# EAGLE schematic NeoGram c0.1 (EAGLE 9.5.2)
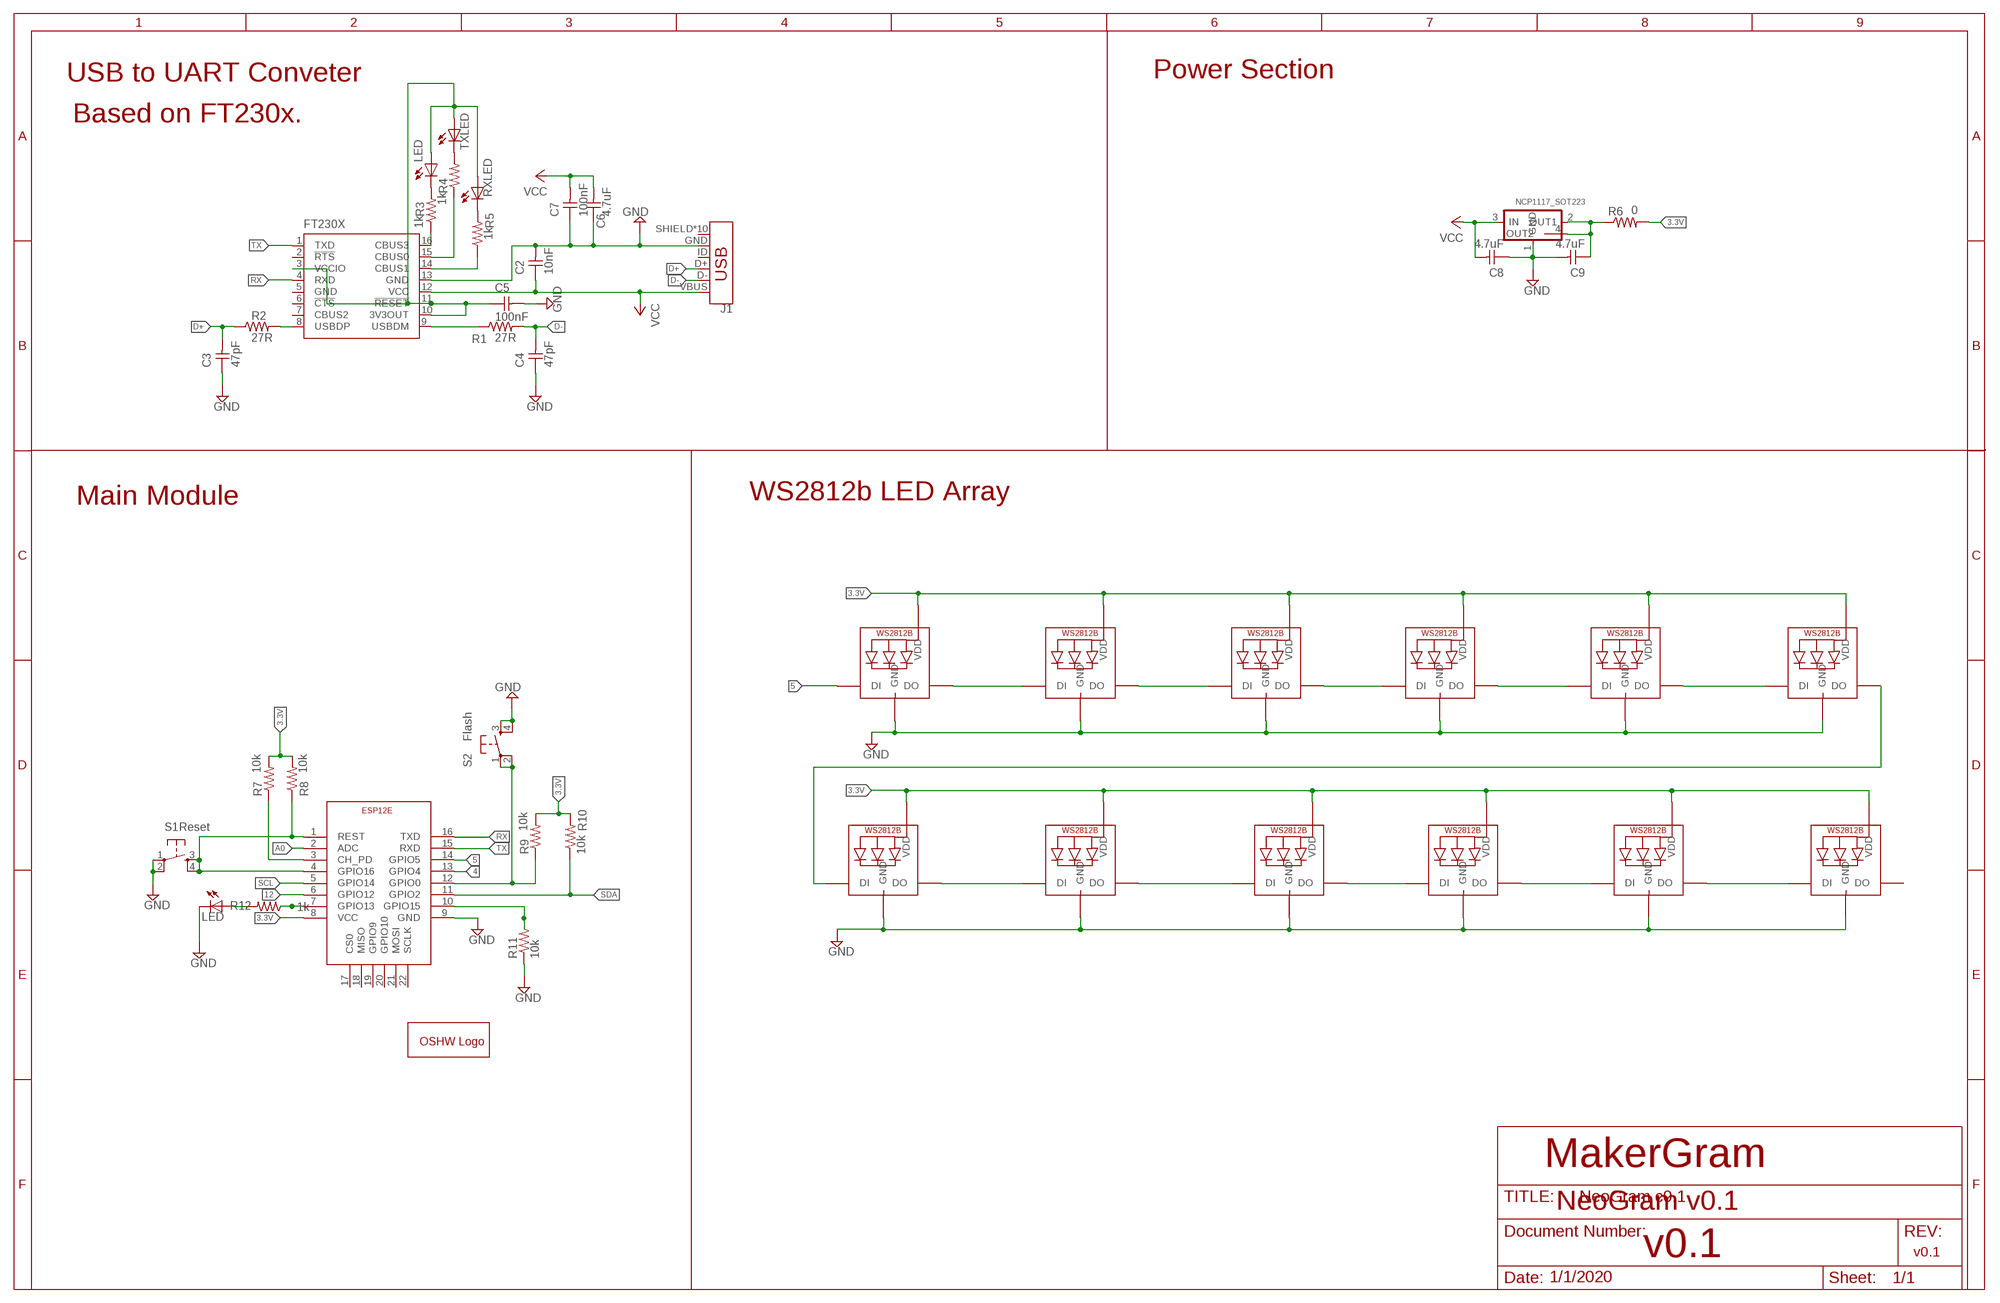
[diagram p0: schematic, sheet 1]

## Parts
C2  10nF  CAP-UNPOLARIZEDFAB  [C1206FAB]
C3  47pF  CAP-UNPOLARIZEDFAB  [C1206FAB]
C4  47pF  CAP-UNPOLARIZEDFAB  [C1206FAB]
C5  100nF  CAP-UNPOLARIZEDFAB  [C1206FAB]
C6  4.7uF  CAP-UNPOLARIZEDFAB  [C1206FAB]
C7  100nF  CAP-UNPOLARIZEDFAB  [C1206FAB]
C8  4.7uF  CAP-UNPOLARIZEDFAB  [C1206FAB]
C9  4.7uF  CAP-UNPOLARIZEDFAB  [C1206FAB]
FT230X  FT230XS  [SSOP16]
GOLD_ORB_SM1  OSHWLOGOLOGO8MM  [OSHW_8MM]
ILED  LED  LEDFAB1206  [LED1206]
J1  USB_MICRO-B_HALF_PTH_MILL  [USB-MICROB-PTH-MILL]
LED  LED  LEDFAB1206  [LED1206]
LED1  WS2812B5050  [WS2812B]
LED2  WS2812B5050  [WS2812B]
LED3  WS2812B5050  [WS2812B]
LED4  WS2812B5050  [WS2812B]
LED5  WS2812B5050  [WS2812B]
LED6  WS2812B5050  [WS2812B]
LED7  WS2812B5050  [WS2812B]
LED8  WS2812B5050  [WS2812B]
LED9  WS2812B5050  [WS2812B]
LED10  WS2812B5050  [WS2812B]
LED11  WS2812B5050  [WS2812B]
LED12  WS2812B5050  [WS2812B]
NCP1117  NCP1117_SOT223  [SOT223]
R1  27R  RES1206FAB  [R1206]
R2  27R  RES1206FAB  [R1206]
R3  1k  RES1206FAB  [R1206]
R4  1k  RES1206FAB  [R1206]
R5  1k  RES1206FAB  [R1206]
R6  0  RES1206FAB  [R1206]
R7  10k  RES1206FAB  [R1206]
R8  10k  RES1206FAB  [R1206]
R9  10k  RES1206FAB  [R1206]
R10  10k  RES1206FAB  [R1206]
R11  10k  RES1206FAB  [R1206]
R12  1k  RES1206FAB  [R1206]
RX  RXLED  LEDFAB1206  [LED1206]
S1  Reset  6MM_SWITCH6MM_SWITCH  [6MM_SWITCH]
S2  Flash  6MM_SWITCH6MM_SWITCH  [6MM_SWITCH]
SJR1  ESP-12EESP12E  [ESP-12E-SOC]
TX  TXLED  LEDFAB1206  [LED1206]

## Nets
3.3V: LED1.1-VDD(VDD) LED2.1-VDD(VDD) LED3.1-VDD(VDD) LED4.1-VDD(VDD) LED5.1-VDD(VDD) LED6.1-VDD(VDD) LED7.1-VDD(VDD) LED8.1-VDD(VDD) LED9.1-VDD(VDD) LED10.1-VDD(VDD) LED11.1-VDD(VDD) LED12.1-VDD(VDD) R6.2 R7.2 R8.2 R9.2 R10.2 SJR1.8(VCC)
4: SJR1.13(GPIO4)
5: LED1.4-DIN(DI) SJR1.14(GPIO5)
12: SJR1.6(GPIO12)
A0: SJR1.2(ADC)
D+: C3.2 J1.D+ R2.1
D-: C4.2 J1.D- R1.2
GND: C2.2 C3.1 C4.1 C5.2 C6.1 C7.1 C8.1 C9.2 FT230X.13(GND) ILED.2(C) J1.GND LED1.3-GND(GND) LED2.3-GND(GND) LED3.3-GND(GND) LED4.3-GND(GND) LED5.3-GND(GND) LED6.3-GND(GND) LED7.3-GND(GND) LED8.3-GND(GND) LED9.3-GND(GND) LED10.3-GND(GND) LED11.3-GND(GND) LED12.3-GND(GND) NCP1117.1(GND) R11.1 S1.1(P) S1.2(P1) S2.3(S) S2.4(S1) SJR1.9(GND)
N$1: FT230X.9(USBDM) R1.1
N$2: FT230X.8(USBDP) R2.2
N$3: R8.1 S1.3(S) S1.4(S1) SJR1.1(REST) SJR1.4(GPIO16)
N$4: C5.1 FT230X.3(VCCIO) FT230X.10(3V3OUT) FT230X.11(!RESET) LED.1(A) RX.1(A) TX.1(A)
N$5: R7.1 SJR1.3(CH_PD)
N$6: FT230X.16(CBUS3) R3.1
N$7: FT230X.15(CBUS0) R4.1
N$8: FT230X.14(CBUS1) R5.1
N$9: R5.2 RX.2(C)
N$10: R4.2 TX.2(C)
N$11: C9.1 NCP1117.2(OUT1) NCP1117.4(OUT2) R6.1
N$12: R9.1 S2.1(P) S2.2(P1) SJR1.12(GPIO0)
N$14: LED.2(C) R3.2
N$15: R11.2 SJR1.10(GPIO15)
N$17: LED1.2-DOUT(DO) LED2.4-DIN(DI)
N$18: R12.1 SJR1.7(GPIO13)
N$19: ILED.1(A) R12.2
N$20: LED2.2-DOUT(DO) LED4.4-DIN(DI)
N$21: LED4.2-DOUT(DO) LED6.4-DIN(DI)
N$22: LED6.2-DOUT(DO) LED8.4-DIN(DI)
N$23: LED3.4-DIN(DI) LED8.2-DOUT(DO)
N$26: LED5.2-DOUT(DO) LED7.4-DIN(DI)
N$27: LED7.2-DOUT(DO) LED10.4-DIN(DI)
N$28: LED9.4-DIN(DI) LED10.2-DOUT(DO)
N$29: LED9.2-DOUT(DO) LED12.4-DIN(DI)
N$30: LED11.4-DIN(DI) LED12.2-DOUT(DO)
N$31: LED3.2-DOUT(DO) LED5.4-DIN(DI)
RX: FT230X.4(RXD) SJR1.16(TXD)
SCL: SJR1.5(GPIO14)
SDA: R10.1 SJR1.11(GPIO2)
TX: FT230X.1(TXD) SJR1.15(RXD)
VCC: C2.1 C6.2 C7.2 C8.2 FT230X.12(VCC) J1.VBUS NCP1117.3(IN)
Unconnected: FT230X.2(!RTS) FT230X.6(!CTS) FT230X.7(CBUS2) J1.ID J1.SHIELD J1.SHIELD2(SHIELD) J1.SHIELD3(SHIELD) J1.SHIELD4(SHIELD) J1.SHIELD5(SHIELD) J1.SHIELD6(SHIELD) J1.SHIELD7(SHIELD) J1.SHIELD8(SHIELD) J1.SHIELD9(SHIELD) J1.SHIELD10(SHIELD) LED11.2-DOUT(DO) SJR1.17(CS0) SJR1.18(MISO) SJR1.19(GPIO9) SJR1.20(GPIO10) SJR1.21(MOSI) SJR1.22(SCLK)

## Notes on the sheet
- USB to UART Conveter | Power Section
- Based on FT230x.
- Main Module | WS2812b LED Array
- MakerGram
- NeoGram v0.1
- v0.1
- v0.1
- 1/1/2020

## Power pins joined to a net without a drawn wire
GND: FT230X.5(GND)

## Library data of the parts
C2-C9 = fab:CAP-UNPOLARIZED
FT230X = MG-ESP8266-Badge:FT230X: USB to BASIC UART IC Auto generated by make-symbol-device-package-bsdl.ulp Rev. 43 Source: Data sheet <http://www.ftdichip.com/Support/Documents/DataSheets/ICs/DS_FT230X.pdf>
GOLD_ORB_SM1 = oshw:OSHWLOGO: The OSHW logo for PCB layout
ILED LED RX TX = MG-ESP8266-Badge:LED: LED
J1 = SparkFun-Connectors:USB_MICRO-B: USB Type Micro-B Connector Male/female and PTH/SMT variants SparkFun Products: SparkFun microB USB Breakout <https://www.sparkfun.com/products/12035> SparkFun USB microB Plug Breakout <https://www.sparkfun.com/products/10031> SparkFun ESP8266 Thing <https://www.sparkfun.com/products/13231>; PROD_ID: CONN-13711
LED1-LED12 = adafruit:WS2812B
NCP1117 = MG-ESP8266-Badge:NCP1117_SOT223
R1-R12 = MG-ESP8266-Badge:RES: Resistor (US Symbol) Variants with postfix FAB are widened to allow the routing of internal traces
S1 S2 = MG-ESP8266-Badge:6MM_SWITCH: 6mm Push Button
SJR1 = MG-ESP8266-Badge:ESP-12E: ESP8266-12E Library for Eagle CAD The author not responsible for any damages or errors!. Created by Salman Faris (0xSalFar).